# Altium schematic sheet Interface1.schdoc
size A4; SheetNumber: 4; SheetTotal: 5
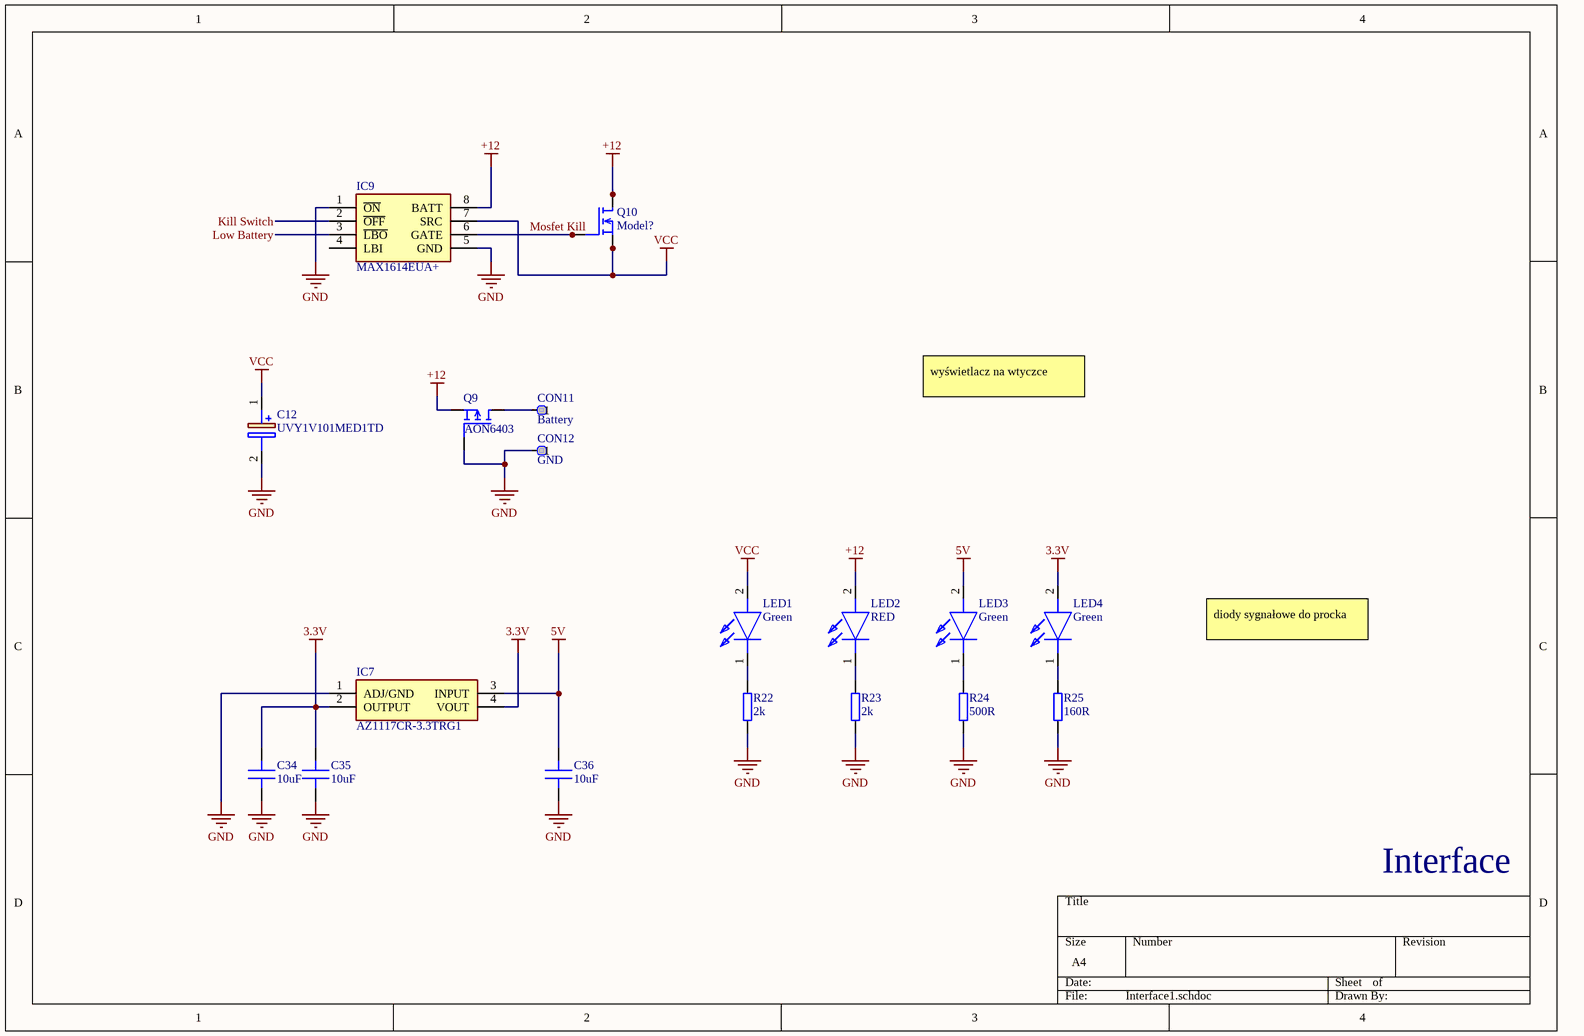
[diagram p0: Interface1.schdoc]

## Parts
C12  UVY1V101MED1TD  [CAPPRD250W50D655H1250]
C34  10uF  [C 0805]
C35  10uF  [C 0805]
C36  10uF  [C 0805]
CON11  Battery  [SMD PAD]
CON12  GND  [SMD PAD]
IC7  AZ1117CR-3.3TRG1  [AZ1117CR33TRG1]
IC9  MAX1614EUA+  [SOP65P490X110-8N]
LED1  Green  [LEDC1608X50N]
LED2  RED  [LEDC1608X50N]
LED3  Green  [LEDC1608X50N]
LED4  Green  [LEDC1608X50N]
Q9  AON6403  [DFN 5x6]
Q10  Model?  [DFN 5x6]
R22  2k  [R 0402]
R23  2k  [R 0402]
R24  500R  [R 0402]
R25  160R  [R 0402]

## Nets
3.3V: C34.1 C35.1 IC7.2(OUTPUT) IC7.4(VOUT) LED4.2(A)
5V: C36.1 IC7.3(INPUT) LED3.2(A)
+12: IC9.8(BATT) LED2.2(A) Q9.1,_2,_3(S) Q10.5_8(D)
GND: C12.2(-) C34.2 C35.2 C36.2 CON12.1 IC7.1(ADJ/GND) IC9.1(~{ON}) IC9.5(GND) Q9.4(G) R22.2 R23.2 R24.2 R25.2
VCC: C12.1(+) IC9.7(SRC) LED1.2(A) Q10.1,2,3(S) Q10.1,_2,_3(S)
Kill Switch: IC9.2(~{OFF})
Low Battery: IC9.3(~{LBO})
Mosfet Kill: IC9.6(GATE) Q10.4(G)
NetCON11_1: CON11.1 Q9.5_8(D)
NetLED1_1: LED1.1(K) R22.1
NetLED2_1: LED2.1(K) R23.1
NetLED3_1: LED3.1(K) R24.1
NetLED4_1: LED4.1(K) R25.1

Not connected (* = marked no-connect by the designer): IC9 4(LBI)

## Notes on the sheet
- wyświetlacz na wtyczce
- diody sygnałowe do procka
- Interface

## Library data of the parts
C12 = UVY1V101MED1TD: Capacitor Polarised; Manufacturer_Name: Nichicon; Datasheet Link: http://nichicon-us.com/english/products/pdfs/e-uvy.pdf; Height: 12.5mm; Manufacturer_Part_Number: UVY1V101MED1TD; Arrow Part Number: UVY1V101MED1TD; Arrow Price/Stock: https://www.arrow.com/en/products/uvy1v101med1td/nichicon
C34-C36 = Capacitor: MLCC Capacitor
CON11 CON12 = 1 Pin
IC7 = AZ1117CR-3.3TRG1: Integrated Circuit; Manufacturer_Name: Diodes Inc.; Datasheet Link: https://www.diodes.com/assets/Datasheets/AZ1117C.pdf; Height: 2mm; Manufacturer_Part_Number: AZ1117CR-3.3TRG1; Mouser Part Number: 621-AZ1117CR-3.3TRG1; Mouser Price/Stock: https://www.mouser.co.uk/ProductDetail/Diodes-Incorporated/AZ1117CR-3.3TRG1?qs=FKu9oBikfSlEg7waHw2tMw%3D%3D; Arrow Part Number: AZ1117CR-3.3TRG1; Arrow Price/Stock: https://www.arrow.com/en/products/az1117cr-3.3trg1/diodes-incorporated?region=nac
IC9 = MAX1614EUA+: Integrated Circuit; Manufacturer_Name: Maxim Integrated; Datasheet Link: http://datasheets.maximintegrated.com/en/ds/MAX1614.pdf; Height: 1.1mm; Manufacturer_Part_Number: MAX1614EUA+; Mouser Part Number: 700-MAX1614EUA; Mouser Price/Stock: https://www.mouser.co.uk/ProductDetail/Maxim-Integrated/MAX1614EUA%2b?qs=1THa7WoU59FiDBRRbRrFJA%3D%3D
LED1-LED4 = 150060GS55040: LED; Manufacturer_Name: Wurth Elektronik; Datasheet Link: https://katalog.we-online.de/led/datasheet/150060GS55040.pdf; Height: 0.5mm; Manufacturer_Part_Number: 150060GS55040; Mouser Part Number: 710-150060GS55040; Mouser Price/Stock: https://www.mouser.co.uk/ProductDetail/Wurth-Elektronik/150060GS55040?qs=fAHHVMwC%252Bbhr5Aln2oA6Nw%3D%3D
Q9 = AON6403: P-Mosfet 30V 67A Rds(on) 3.1mR
Q10 = Power MOSFET: N-Mosfet DFN 5x6
R22-R25 = Resistor: General pourpouse resistor